# Altium schematic sheet [02] MCU.SchDoc: MCU
size A4
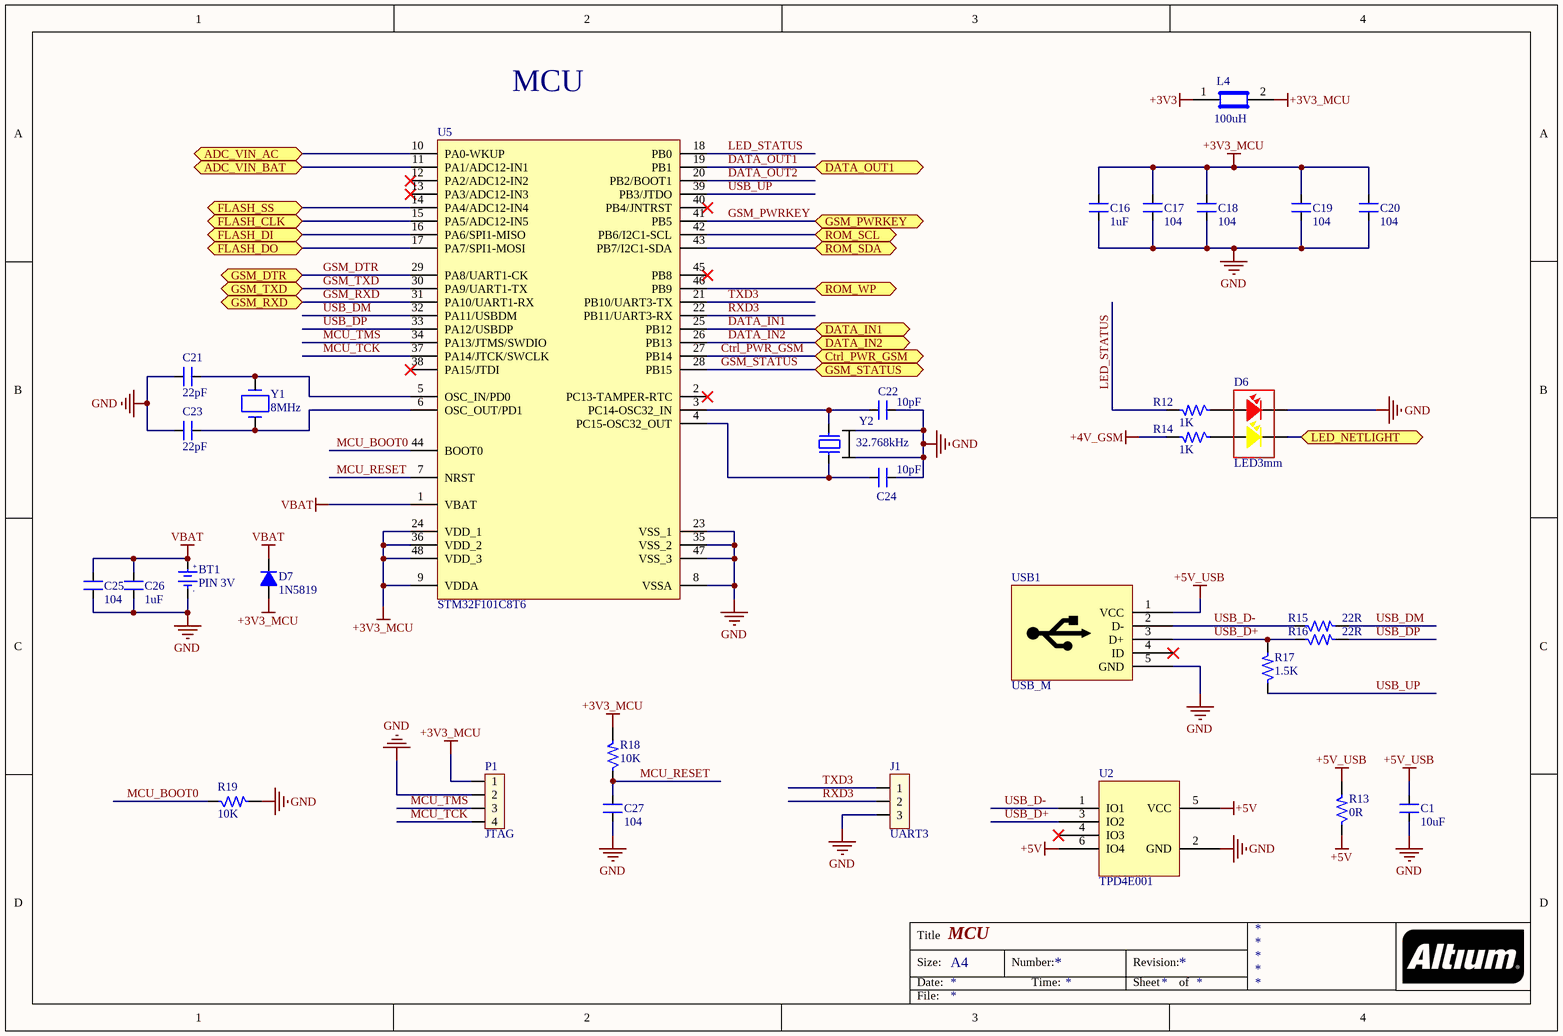
[diagram p0: [02] MCU.SchDoc]

## Parts
BT1  PIN 3V  [CR1220 socket]
C1  10uF  [C0603 SMT]
C16  1uF  [C0603 SMT]
C17  104  [C0603 SMT]
C18  104  [C0603 SMT]
C19  104  [C0603 SMT]
C20  104  [C0603 SMT]
C21  22pF  [C0603 SMT]
C22  10pF  [C0603 SMT]
C23  22pF  [C0603 SMT]
C24  10pF  [C0603 SMT]
C25  104  [C0603 SMT]
C26  1uF  [C0603 SMT]
C27  104  [C0603 SMT]
D6  LED3mm  [LED 2 holder 3mm]
D7  1N5819  [SOD123]
J1  UART3  [JP3]
L4  100uH  [R0805]
P1  JTAG  [JP1x4]
R12  1K  [R0603 -SMT]
R13  0R  [R0805 SMT]
R14  1K  [R0603 -SMT]
R15  22R  [R0603 -SMT]
R16  22R  [R0603 -SMT]
R17  1.5K  [R0603 -SMT]
R18  10K  [R0603 -SMT]
R19  10K  [R0603 -SMT]
U2  TPD4E001  [TPD4E001 DBV]
U5  STM32F101C8T6  [LQFP48-B]
USB1  USB_M  [USB_B_MINI_SMD]
Y1  8MHz  [ABM7_v1_1_BIG]
Y2  32.768kHz  [XT-SMD MC306]

## Ports
ADC_VIN_AC, ADC_VIN_BAT, Ctrl_PWR_GSM, DATA_IN1, DATA_IN2, DATA_OUT1, FLASH_CLK, FLASH_DI, FLASH_DO, FLASH_SS, GSM_DTR, GSM_PWRKEY, GSM_RXD, GSM_STATUS, GSM_TXD, LED_NETLIGHT, ROM_SCL, ROM_SDA, ROM_WP

## Nets
+3V3: L4.1
+3V3_MCU: C16.2 C17.2 C18.2 C19.2 C20.2 D7.1(A) L4.2 P1.1 R18.2 U5.9(VDDA) U5.24(VDD_1) U5.36(VDD_2) U5.48(VDD_3)
+4V_GSM: R14.2
+5V: R13.1 U2.5(VCC) U2.6(IO4)
+5V_USB: C1.2 R13.2 USB1.1(VCC)
GND: BT1.2(GND) C1.1 C16.1 C17.1 C18.1 C19.1 C20.1 C21.2 C22.2 C23.2 C24.2 C25.1 C26.1 C27.2 D6.1 J1.3 P1.2 R19.2 U2.2(GND) U5.8(VSSA) U5.23(VSS_1) U5.35(VSS_2) U5.47(VSS_3) USB1.5(GND) Y2.2 Y2.3
VBAT: BT1.1(+3V) C25.2 C26.2 D7.2(K) U5.1(VBAT)
ADC_VIN_AC: U5.10(PA0-WKUP) ; port ADC_VIN_AC
ADC_VIN_BAT: U5.11(PA1/ADC12-IN1) ; port ADC_VIN_BAT
Ctrl_PWR_GSM: U5.27(PB14) ; port Ctrl_PWR_GSM
DATA_IN1: U5.25(PB12) ; port DATA_IN1
DATA_IN2: U5.26(PB13) ; port DATA_IN2
DATA_OUT1: U5.19(PB1) ; port DATA_OUT1
DATA_OUT2: U5.20(PB2/BOOT1)
FLASH_CLK: U5.15(PA5/ADC12-IN5) ; port FLASH_CLK
FLASH_DI: U5.16(PA6/SPI1-MISO) ; port FLASH_DI
FLASH_DO: U5.17(PA7/SPI1-MOSI) ; port FLASH_DO
FLASH_SS: U5.14(PA4/ADC12-IN4) ; port FLASH_SS
GSM_DTR: U5.29(PA8/UART1-CK) ; port GSM_DTR
GSM_PWRKEY: U5.41(PB5) ; port GSM_PWRKEY
GSM_RXD: U5.31(PA10/UART1-RX) ; port GSM_RXD
GSM_STATUS: U5.28(PB15) ; port GSM_STATUS
GSM_TXD: U5.30(PA9/UART1-TX) ; port GSM_TXD
LED_NETLIGHT: D6.3 ; port LED_NETLIGHT
LED_STATUS: R12.2 U5.18(PB0)
MCU_BOOT0: R19.1 U5.44(BOOT0)
MCU_RESET: C27.1 R18.1 U5.7(NRST)
MCU_TCK: P1.4 U5.37(PA14/JTCK/SWCLK)
MCU_TMS: P1.3 U5.34(PA13/JTMS/SWDIO)
ROM_SCL: U5.42(PB6/I2C1-SCL) ; port ROM_SCL
ROM_SDA: U5.43(PB7/I2C1-SDA) ; port ROM_SDA
ROM_WP: U5.46(PB9) ; port ROM_WP
RXD3: J1.2 U5.22(PB11/UART3-RX)
TXD3: J1.1 U5.21(PB10/UART3-TX)
USB_D+: R16.1 R17.2 U2.3(IO2) USB1.3(D+)
USB_D-: R15.1 U2.1(IO1) USB1.2(D-)
USB_DM: R15.2 U5.32(PA11/USBDM)
USB_DP: R16.2 U5.33(PA12/USBDP)
USB_UP: R17.1 U5.39(PB3/JTDO)
NetC21_1: C21.1 U5.5(OSC_IN/PD0) Y1.1
NetC22_1: C22.1 U5.3(PC14-OSC32_IN) Y2.1
NetC23_1: C23.1 U5.6(OSC_OUT/PD1) Y1.2
NetC24_1: C24.1 U5.4(PC15-OSC32_OUT) Y2.4
NetD6_2: D6.2 R12.1
NetD6_4: D6.4 R14.1

Not connected (* = marked no-connect by the designer): U2 4(IO3)*; U5 2(PC13-TAMPER-RTC)* 12(PA2/ADC12-IN2)* 13(PA3/ADC12-IN3)* 38(PA15/JTDI)* 40(PB4/JNTRST)* 45(PB8)*; USB1 4(ID)*

## Notes on the sheet
- MCU
- Title
- Size:
- Date:
- A4
- Number:
- Time:
- Revision:
- Sheet
- of
- File:
- (in symbol PIN 3V) +; -

## Library data of the parts
BT1 = PIN 3V: Battery 3VDC; Value: PIN 3V
C1 C16-C27 = CM: Cap SMD; Value: 103
D6 = LED2Holder_3: LED 2 holder RGB 3mm; Value: LED 3 ly Single Colour
D7 = D1A: Diode 1A; Value: 1N4007
J1 = JP3: Jumper 3; Value: J3
L4 = Ferrite Bead: 100uH 0805
P1 = JP4
R12 R14 = RM: Resistor SMD; Value: 1K
R13 R15-R19 = RM: Resistor SMD; Value: 1K
U5 = STM32F101C8T6: STM32 ARM-based 32-bit MCU with 32 Kbytes Flash, 48-pin LQFP, Industrial Temperature
Y1 = ABM7-16.000MHZ-D2Y-T: CRYSTAL 16MHZ 18PF SMD; Manufacturer: Abracon LLC; Frequency Stability: ±30ppm; Frequency Tolerance: ±20ppm; ESR (Equivalent Series Resistance): 50 Ohm; Operating Mode: Fundamental; .Creator: MM; .Checked PCB: RF; Supplier 1: Digi-Key; Manufacturer Part Number: ABM7-16.000MHZ-D2Y-T; RoHS: RoHS Compliant; Category: Crystals and Oscillators; Stock 1: 5861; Pricing 1: 1=0.96, 10=0.847, 50=0.791, 100=0.7, 500=0.6615 (USD); Packaging: Cut Tape (CT); Type: MHz Crystal; Frequency: 16MHz; Load Capacitance: 18pF; Operating Temperature: -40°C ~ 85°C; Ratings: -; Mounting Type: Surface Mount; Package / Case: 2-SMD; Size / Dimension: 0.236" L x 0.138" W (6.00mm x 3.50mm); Height: 0.055" (1.40mm); ComponentLink1URL: http://www.abracon.com/Resonators/abm7.pdf; ComponentLink1Description: http://www.abracon.com/Resonators/abm7.pdf; Supplier Part Number 1: 535-9840-1-ND; .Checked SCH: RF
Y2 = XT4_SMD_MC306: Crystal SMD 6035 - 4 Pads; Value: 4Mhz